# Altium project curly-potato.PrjPcb
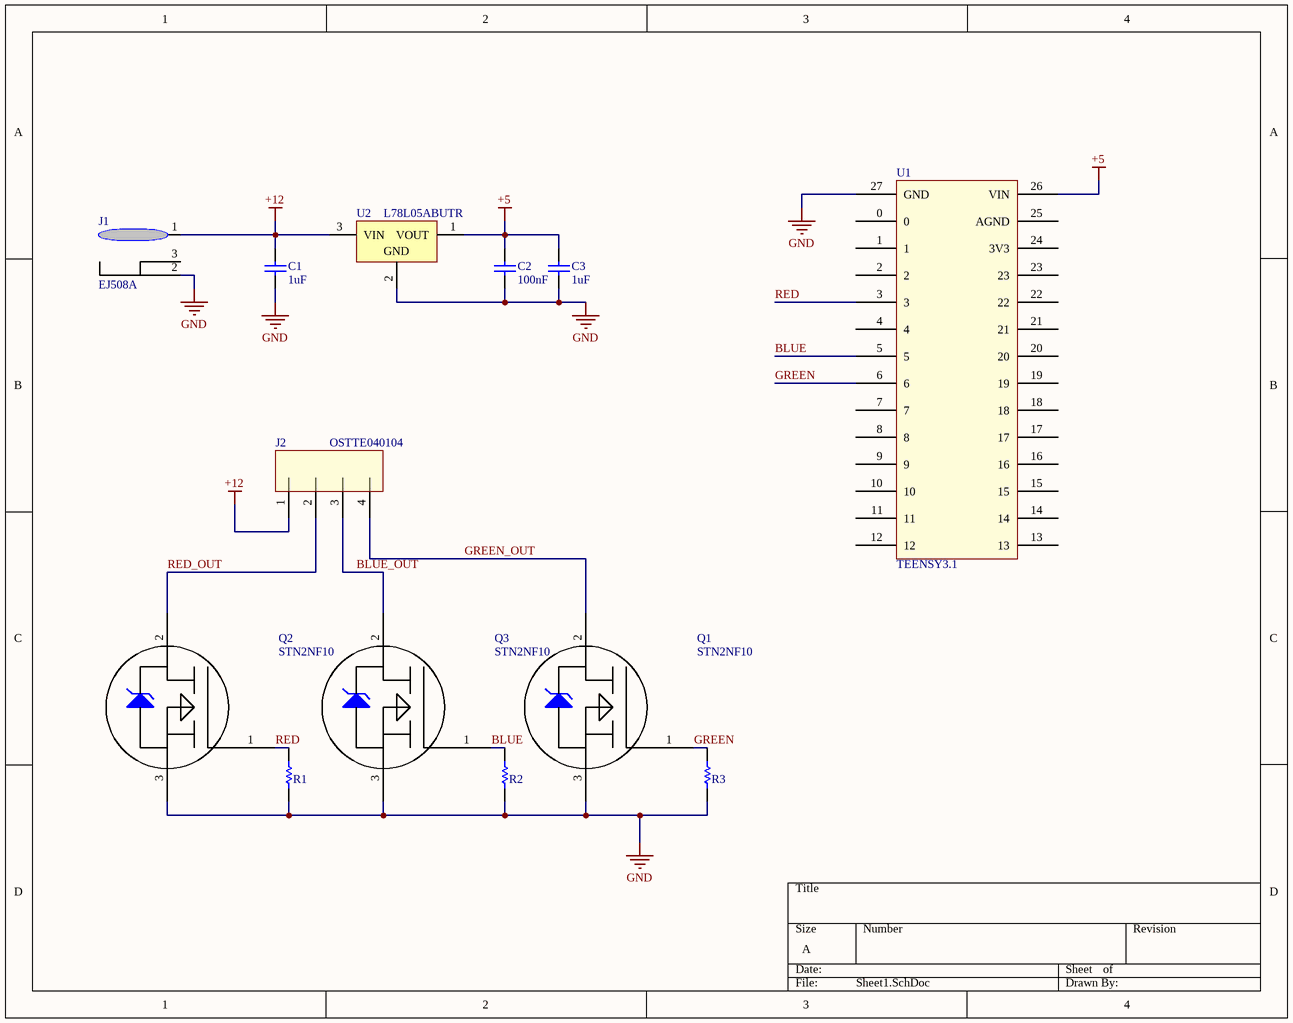
[diagram p0: Sheet1.SchDoc]
1 sheet, 13 parts. Net scope: global (net labels, ports and power ports of the same name join across sheets).

## Sheet Sheet1.SchDoc
size A

### Parts
C1  1uF  [CAPC0805(2012)100_M]
C2  100nF  [CAPC0402(1005)60_M]
C3  1uF  [CAPC0805(2012)100_M]
J1  EJ508A  [2.1MM JACK]
J2  OSTTE040104  [OSTTE040104]
Q1  STN2NF10  [SOT-223]
Q2  STN2NF10  [SOT-223]
Q3  STN2NF10  [SOT-223]
R1  100K 5% 0402(1005)  [RESC0402(1005)_L]  (value not drawn)
R2  100K 5% 0402(1005)  [RESC0402(1005)_L]  (value not drawn)
R3  100K 5% 0402(1005)  [RESC0402(1005)_L]  (value not drawn)
U1  TEENSY3.1  [TEENSY3.1]
U2  L78L05ABUTR  [SOT-89_N]

### Nets
+5: C2.2 C3.2 U1.26(VIN) U2.1(VOUT)
+12: C1.2 J1.1 U2.3(VIN)
GND: C1.1 C2.1 C3.1 J1.2 Q1.3(S) Q2.3(S) Q3.3(S) R1.1 R2.1 R3.1 U1.27(GND) U2.2(GND)
BLUE: Q3.1(G) R2.2 U1.5
BLUE_OUT: Q3.2(D)
GREEN: Q1.1(G) R3.2 U1.6
GREEN_OUT: Q1.2(D)
RED: Q2.1(G) R1.2 U1.3
RED_OUT: Q2.2(D)

Not connected (* = marked no-connect by the designer): J1 3; J2 1 2 3 4; U1 0 1 2 4 7 8 9 10 11 12 13 14 15 16 17 18 19 20 21 22 23 24(3V3) 25(AGND)

### Library data of the parts
C1 = CMP-1036-04754-1: CAP 1uF 25V ±10% 0805 (2012 Metric) Thickness 1mm SMD; Case-EIA: 0805; Case-Metric: 2012; Tolerance: Â±10%; Max Thickness: 1 mm; Value: 1uF; Rated Voltage: 25 V; Technology: SMT
C2 = CMP-1034-02070-1: CAP 100nF 16V ±20% 0402 (1005 Metric) Thickness 0.6mm SMD; Tolerance: Â±20%; Case-EIA: 0402; Case-Metric: 1005; Value: 100nF; Max Thickness: 0.6 mm; Technology: SMT; Rated Voltage: 16 V
C3 = CMP-1036-04754-1: CAP 1uF 16V ±10% 0805 (2012 Metric) Thickness 1mm SMD; Case-EIA: 0805; Case-Metric: 2012; Tolerance: Â±10%; Rated Voltage: 25 V; Max Thickness: 1 mm; Value: 1uF; Technology: SMT
J1 = EJ508A: Power Barrel Connector Jack 2.10mm ID (0.083"), 5.50mm OD (0.217") Through Hole, Right Angle; Manufacturer: Memory Protection Devices; PartNumber: EJ508A
J2 = OSTTE040104: TERMINAL BLOCK 3.5MM 4POS PCB
Q1-Q3 = STN2NF10: MOSFET N-CH 100V 2.4A SOT-223
R1-R3 = CMP-1011-00122-1: 100K 0.063W 5% 0402 (1005 Metric)  SMD; Value: 100000.00 Ohm; Case-EIA: 0402; Case-Metric: 1005; Power: 0.063 W; Technology: SMT; Tolerance: 5 %
U2 = CMP-0244-00406-1: Positive Voltage Regulator, 5V, 4-Pin SOT-89, Tape and Reel; PackageVersion: 2011; DatasheetVersion: 1/02/2011; PackageDescription: 3-Pin SOT-89 Package 1.5 mm Pitch, 4.1 mm Lead Span; PackageReference: SOT-89; ComponentLink2Description: Datasheet; ComponentLink1URL: http://www.st.com; ComponentLink1Description: Manufacturer URL; ComponentLink2URL: http://www.st.com/internet/com/TECHNICAL_RESOURCES/TECHNICAL_LITERATURE/DATASHEET/CD00000446.pdf